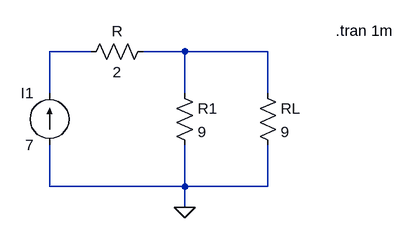
[diagram p0: schematic Q4 att 1.asc]
Q4 att 1.asc, the LTspice schematic file:
Version 4.1
SHEET 1 880 680
WIRE 64 80 0 80
WIRE 208 80 144 80
WIRE 336 80 208 80
WIRE 0 144 0 80
WIRE 208 144 208 80
WIRE 336 144 336 80
WIRE 0 288 0 224
WIRE 208 288 208 224
WIRE 208 288 0 288
WIRE 336 288 336 224
WIRE 336 288 208 288
WIRE 208 320 208 288
FLAG 208 320 0
SYMBOL current 0 224 R180
WINDOW 0 24 80 Left 2
WINDOW 3 24 0 Left 2
WINDOW 123 0 0 Left 0
WINDOW 39 0 0 Left 0
SYMATTR InstName I1
SYMATTR Value 7
SYMBOL res 160 64 R90
WINDOW 0 0 56 VBottom 2
WINDOW 3 32 56 VTop 2
SYMATTR InstName R
SYMATTR Value 2
SYMBOL res 192 128 R0
SYMATTR InstName R1
SYMATTR Value 9
SYMBOL res 320 128 R0
SYMATTR InstName RL
SYMATTR Value 9
TEXT 440 48 Left 2 !.tran 1m

The netlist it stands for:
* Q4 att 1.asc
I1 0 N001 7
R N002 N001 2
R1 N002 0 9
RL N002 0 9
.tran 1m
.backanno
.end